# Altium schematic sheet SCH_SX1262_Antenna.SchDoc
size A4; SheetNumber: 1; SheetTotal: 1
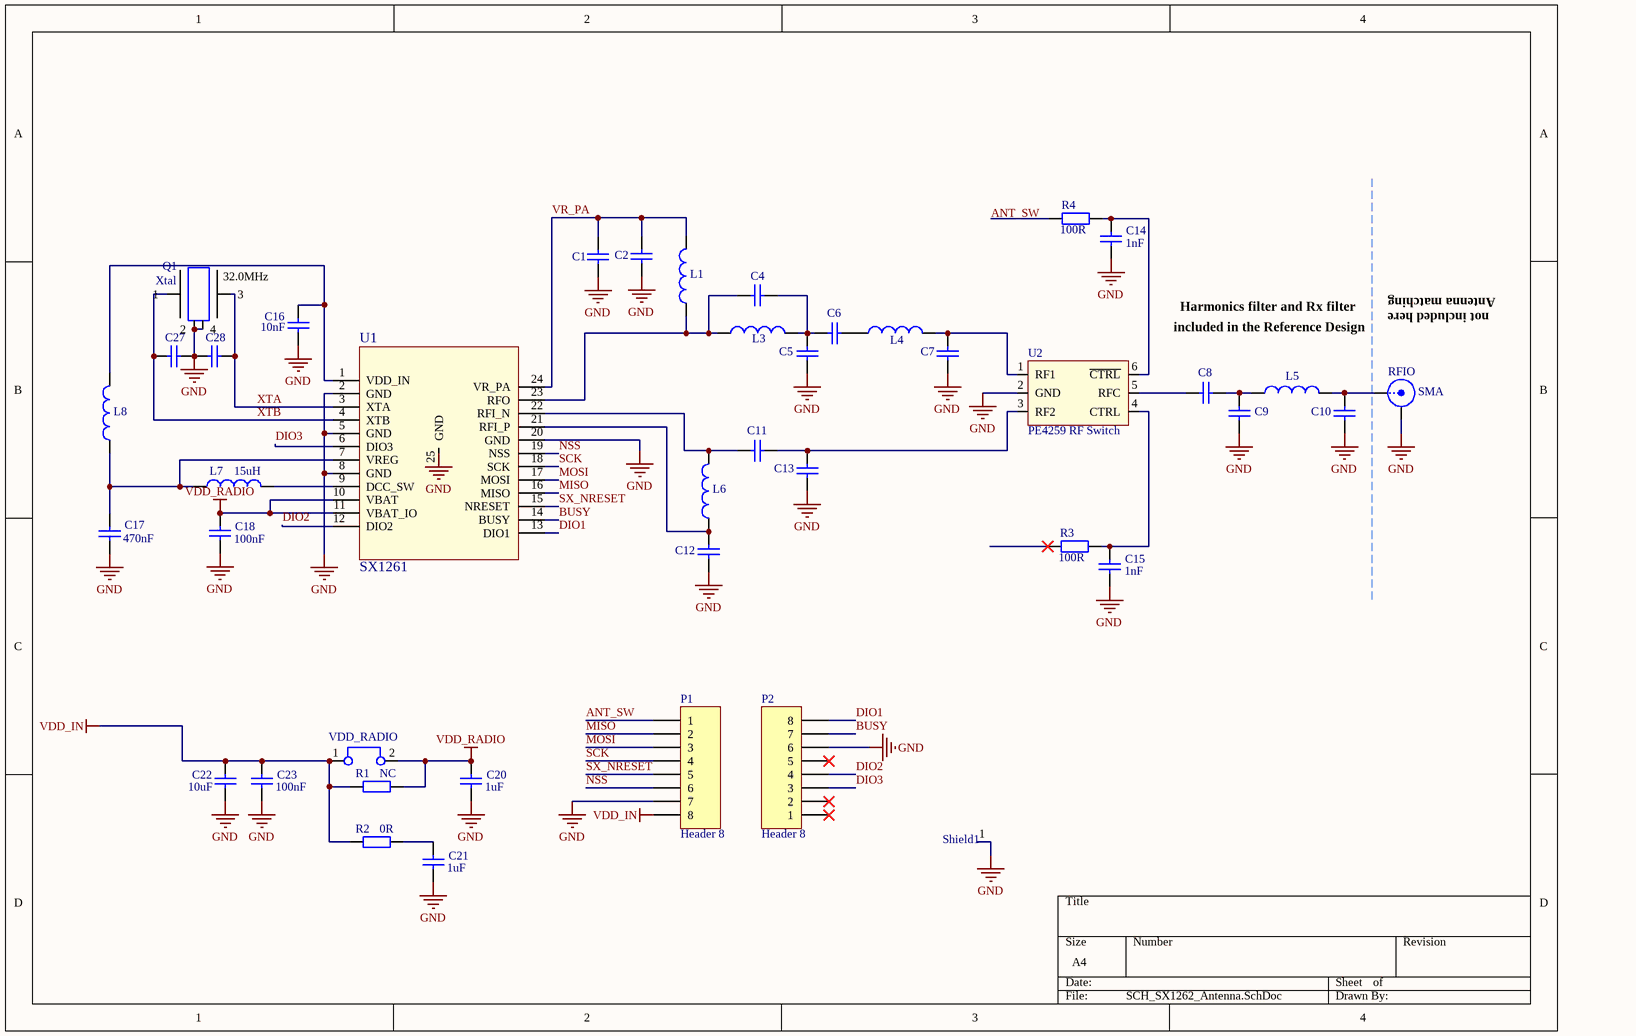
[diagram p0: SCH_SX1262_Antenna.SchDoc]

## Parts
C1  Cap  [rlc_402_smd]  (value not drawn)
C2  Cap  [rlc_402_smd]  (value not drawn)
C4  Cap  [rlc_402_smd]  (value not drawn)
C5  Cap  [rlc_402_smd]  (value not drawn)
C6  Cap  [rlc_402_smd]  (value not drawn)
C7  Cap  [rlc_402_smd]  (value not drawn)
C8  Cap  [rlc_402_smd]  (value not drawn)
C9  Cap  [rlc_402_smd]  (value not drawn)
C10  Cap  [rlc_402_smd]  (value not drawn)
C11  Cap  [rlc_402_smd]  (value not drawn)
C12  Cap  [rlc_402_smd]  (value not drawn)
C13  Cap  [rlc_402_smd]  (value not drawn)
C14  value 1nF  [rlc_402_smd]  (hidden comment: Cap)
C15  value 1nF  [rlc_402_smd]  (hidden comment: Cap)
C16  value 10nF  [rlc_402_smd]  (hidden comment: Cap)
C17  value 470nF  [rlc_402_smd]  (hidden comment: Cap)
C18  value 100nF  [rlc_402_smd]  (hidden comment: Cap)
C20  value 1uF  [rlc_603_smd]  (hidden comment: Cap)
C21  value 1uF  [rlc_603_smd]  (hidden comment: Cap)
C22  value 10uF  [rlc_805_smd]  (hidden comment: Cap)
C23  value 100nF  [rlc_402_smd]  (hidden comment: Cap)
C27  Cap  [rlc_402_smd]  (value not drawn)
C28  Cap  [rlc_402_smd]  (value not drawn)
L1  Inductor  [rlc_402_smd]  (value not drawn)
L3  Inductor  [rlc_402_smd]  (value not drawn)
L4  Inductor  [rlc_402_smd]  (value not drawn)
L5  Inductor  [rlc_402_smd]  (value not drawn)
L6  Inductor  [rlc_402_smd]  (value not drawn)
L7  value 15uH  [rlc_805_smd enlarged]  (hidden comment: Inductor)
L8  Inductor  [rlc_402_smd]  (value not drawn)
P1  Header 8  [HDR1X8]
P2  Header 8  [HDR1X8]
Q1  Xtal  value 32.0MHz  [nd2016da]
R1  value NC  [rlc_603_smd]  (hidden comment: Resistor)
R2  value 0R  [rlc_603_smd]  (hidden comment: Resistor)
R3  value 100R  [rlc_402_smd]  (hidden comment: Resistor)
R4  value 100R  [rlc_402_smd]  (hidden comment: Resistor)
RFIO  SMA  [SMA_end_launch_1.0mm_9.52mm]
Shield1  Logo symbol  [BMIS-209-F - Shield]  (value not drawn)
U1  SX1261  [vqfn24_4x4mm]
U2  PE4259 RF Switch  [SC70-6]
VDD_RADIO  Jumper  [bridge_254mm]  (value not drawn)

## Nets
GND: C1.1 C2.1 C5.1 C7.1 C9.1 C10.1 C12.1 C13.1 C14.2 C15.2 C16.1 C17.1 C18.1 C20.1 C21.1 C22.1 C23.1 C27.1 C28.2 P1.7 P2.6 Q1.2 Q1.4 RFIO.2(GND) Shield1.1 U1.2(GND) U1.5(GND) U1.8(GND) U1.20(GND) U1.25(GND) U2.2(GND)
VDD_IN: C22.2 C23.2 P1.8 R1.2 R2.2 VDD_RADIO.1
VDD_RADIO: C18.2 C20.2 R1.1 U1.10(VBAT) U1.11(VBAT_IO) VDD_RADIO.2
ANT_SW: P1.1
BUSY: P2.7 U1.14(BUSY)
DIO1: P2.8 U1.13(DIO1)
DIO2: P2.4 U1.12(DIO2)
DIO3: P2.3 U1.6(DIO3)
MISO: P1.2 U1.16(MISO)
MOSI: P1.3 U1.17(MOSI)
NSS: P1.6 U1.19(NSS)
SCK: P1.4 U1.18(SCK)
SX_NRESET: P1.5 U1.15(NRESET)
VR_PA: C1.2 C2.2 L1.2 U1.24(VR_PA)
XTA: C28.1 Q1.3 U1.3(XTA)
XTB: C27.2 Q1.1 U1.4(XTB)
NetC4_1: C4.1 C5.2 C6.2 L3.2
NetC4_2: C4.2 L1.1 L3.1 U1.23(RFO)
NetC6_1: C6.1 L4.1
NetC7_2: C7.2 L4.2 U2.1(RF1)
NetC8_1: C8.1 C9.2 L5.1
NetC8_2: C8.2 U2.5(RFC)
NetC10_2: C10.2 L5.2 RFIO.1(Signal)
NetC11_1: C11.1 C13.2 U2.3(RF2)
NetC11_2: C11.2 L6.2 U1.22(RFI_N)
NetC12_2: C12.2 L6.1 U1.21(RFI_P)
NetC14_1: C14.1 R4.1 U2.6(~{CTRL})
NetC15_1: C15.1 R3.1 U2.4(CTRL)
NetC16_2: C16.2 L8.1 U1.1(VDD_IN)
NetC17_2: C17.2 L7.1 L8.2 U1.7(VREG)
NetC21_2: C21.2 R2.1
NetL7_2: L7.2 U1.9(DCC_SW)

Not connected (* = marked no-connect by the designer): P2 1* 2* 5*; R3 2*; R4 2

## Notes on the sheet
- Harmonics filter and Rx filter
- not included here
- Antenna matching
- included in the Reference Design
- Labels drawn without touching a wire or pin: ANT_SW

## Library data of the parts
C1 C2 C4-C13 C27 C28 = Cap: Capacitor SMD; Value: NC; Published: 8-Jun-2000; LatestRevisionDate: 05-oct-2007  -  Semtech; LatestRevisionNote: Re-released for DXP Platform.; Publisher: Altium Limited
C14-C18 C20-C23 = Cap: Capacitor SMD; Published: 8-Jun-2000; LatestRevisionDate: 05-oct-2007  -  Semtech; LatestRevisionNote: Re-released for DXP Platform.; Publisher: Altium Limited
L1 L3-L6 = Inductor: Inductor SMD; Code_IEC: 1005; Value: 0R; Published: 8-Jun-2000; LatestRevisionDate: 05-oct-2007  -  Semtech; LatestRevisionNote: Re-released for DXP Platform.; Publisher: Altium Limited; Code_JEITA: 0402
L7 = Inductor: Inductor SMD; Code_IEC: 1005; Published: 8-Jun-2000; LatestRevisionDate: 05-oct-2007  -  Semtech; LatestRevisionNote: Re-released for DXP Platform.; Publisher: Altium Limited; Code_JEITA: 0402
L8 = Inductor: Inductor SMD; Value: 47nH; Code_IEC: 1005; LatestRevisionDate: 05-oct-2007  -  Semtech; Published: 8-Jun-2000; LatestRevisionNote: Re-released for DXP Platform.; Publisher: Altium Limited; Code_JEITA: 0402
P1 P2 = Header 8: Header, 8-Pin; LatestRevisionDate: 17-Jul-2002; LatestRevisionNote: Re-released for DXP Platform.; Publisher: Altium Limited
Q1 = Xtal GND: Crystal with GND pins; LatestRevisionDate: 05-oct-2007  -  Semtech
R1-R4 = Resistor: Resistor SMD - IEC symbol version; LatestRevisionDate: 27-Jul-20  -  Semtech
RFIO = SMA: SMA Straight Connector; LatestRevisionDate: 05-oct-2007  -  Semtech; LatestRevisionNote: Re-released for DXP Platform.; Publisher: Altium Limited
Shield1 = Shield: Shield - EMI Gasket - Standard Surface Mount Shields
U1 = SX126x: SX1261/2 - Ultra low power RF transceiver
U2 = PE4259 RF Switch: PE4259 Peregrine RF Switch; LatestRevisionDate: 03-Sep-2012 -  Semtech
VDD_RADIO = Jumper: Jumper Wire; LatestRevisionDate: 05-oct-2007  -  Semtech